# EAGLE design controll (EAGLE 4.90)
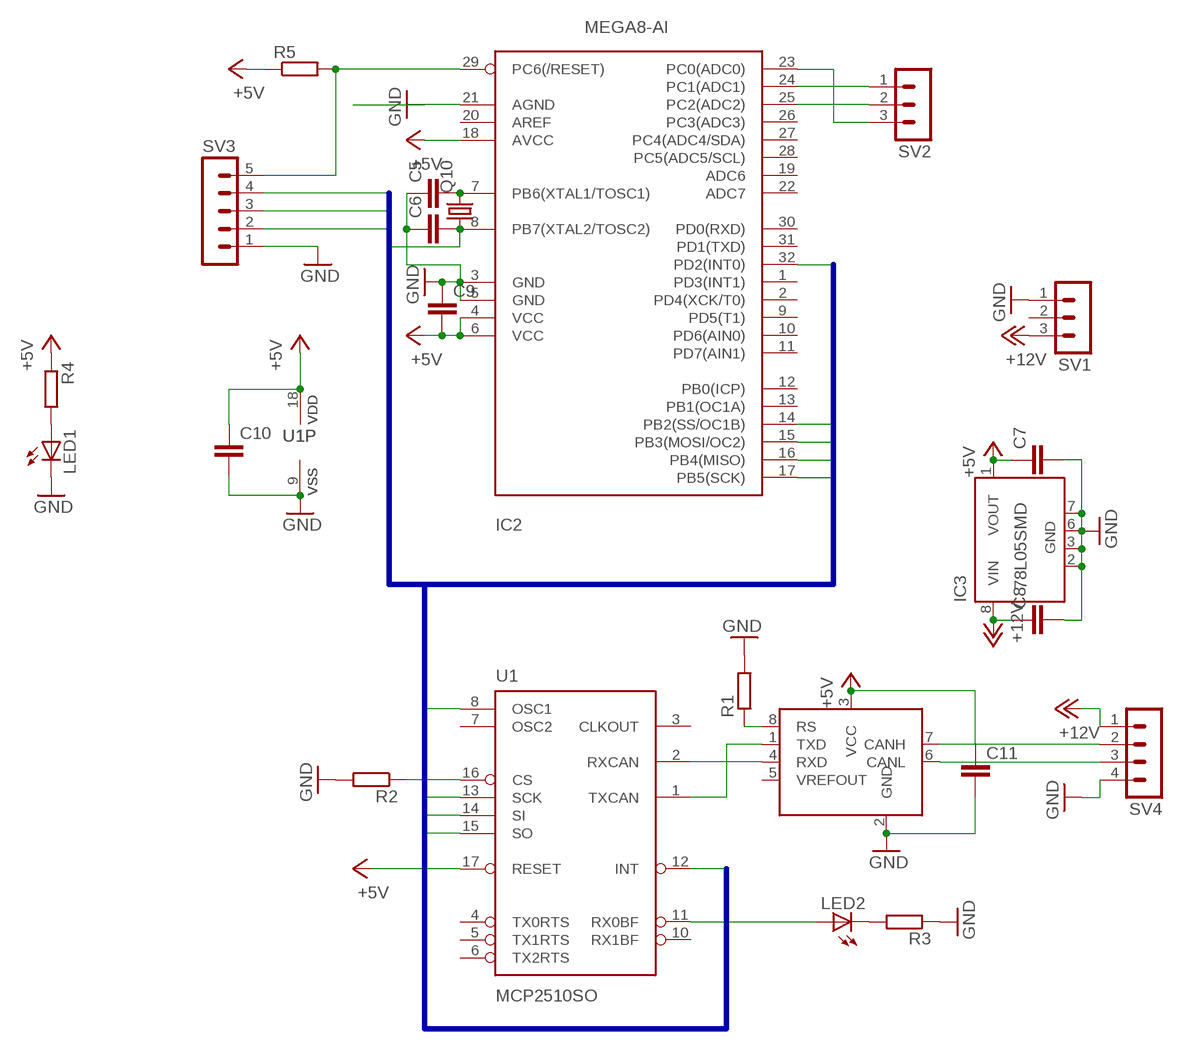
[diagram p0: schematic, sheet 1]

## Parts
C5  C-EUC1206  [C1206]
C6  C-EUC0805  [C0805]
C7  C-EUC0805  [C0805]
C8  C-EUC0805  [C0805]
C9  C-EUC0805  [C0805]
C10  C-EUC0805  [C0805]
C11  C-EUC0805  [C0805]
IC1  82C250SMDSMD  [SO8]
IC2  MEGA8-AI  [TQFP32-08]
IC3  78L05SMD  [SO08]
LED1  LEDCHIPLED_0603  [CHIPLED_0603]
LED2  LEDCHIPLED_0603  [CHIPLED_0603]
Q10  CRYTALHC49S  [HC49/S]
R1  R-EU_R0805  [R0805]
R2  R-EU_R0805  [R0805]
R3  R-EU_R0805  [R0805]
R4  R-EU_R0805  [R0805]
R5  R-EU_R1206  [R1206]
SV1  MA03-1  [MA03-1]
SV2  MA03-1  [MA03-1]
SV3  MA05-1  [MA05-1]
SV4  MA04-1  [MA04-1]
U1  MCP2510SO  [SO-18W]

## Nets
+5V: C7.1 C9.2 C10.1 C11.1 IC1.3(VCC) IC2.4(VCC) IC2.6(VCC) IC2.18(AVCC) IC3.1(VOUT) R4.1 R5.1 U1.17(RESET) U1.18(VDD)
+12V: C8.1 IC3.8(VIN) SV1.3 SV4.1
CLK: C6.2 IC2.8(PB7(XTAL2/TOSC2)) Q10.1 U1.8(OSC1)
GND: C5.1 C6.1 C7.2 C8.2 C9.1 C10.2 C11.2 IC1.2(GND) IC2.3(GND) IC2.5(GND) IC2.21(AGND) IC3.2(GND) IC3.3(GND) IC3.6(GND) IC3.7(GND) LED1.C R1.2 R2.2 R3.1 SV1.1 SV3.1 SV4.4 U1.9(VSS)
INT: IC2.32(PD2(INT0)) U1.12(INT)
MISO: IC2.16(PB4(MISO)) SV3.2 U1.15(SO)
MOSI: IC2.15(PB3(MOSI/OC2)) SV3.3 U1.14(SI)
N$1: IC2.24(PC1(ADC1)) SV2.1
N$2: IC2.23(PC0(ADC0)) SV2.3
N$3: IC2.25(PC2(ADC2)) SV2.2
N$4: IC2.29(PC6(/RESET)) R5.2 SV3.5
N$15: C5.2 IC2.7(PB6(XTAL1/TOSC1)) Q10.2
N$30: LED1.A R4.2
N$34: IC1.7(CANH) SV4.2
N$35: IC1.1(TXD) U1.1(TXCAN)
N$36: IC1.4(RXD) U1.2(RXCAN)
N$37: IC1.8(RS) R1.1
N$38: IC1.6(CANL) SV4.3
N$39: LED2.A U1.11(RX0BF)
N$40: LED2.C R3.2
SCK: IC2.17(PB5(SCK)) SV3.4 U1.13(SCK)
SS: IC2.14(PB2(SS/OC1B)) R2.1 U1.16(CS)
Unconnected: IC1.5(VREFOUT) IC2.1(PD3(INT1)) IC2.2(PD4(XCK/T0)) IC2.9(PD5(T1)) IC2.10(PD6(AIN0)) IC2.11(PD7(AIN1)) IC2.12(PB0(ICP)) IC2.13(PB1(OC1A)) IC2.19(ADC6) IC2.20(AREF) IC2.22(ADC7) IC2.26(PC3(ADC3)) IC2.27(PC4(ADC4/SDA)) IC2.28(PC5(ADC5/SCL)) IC2.30(PD0(RXD)) IC2.31(PD1(TXD)) IC3.4(NC) IC3.5(NC) SV1.2 U1.3(CLKOUT) U1.4(TX0RTS) U1.5(TX1RTS) U1.6(TX2RTS) U1.7(OSC2) U1.10(RX1BF)

## Buses
SPI:SS,MOSI,MISO,SCK,INT,CLK

## Library data of the parts
C5-C11 = rcl:C-EU: CAPACITOR, European symbol
IC1 = philips:82C250SMD
IC2 = atmel:MEGA8: MICROCONTROLLER 8 Kbytes FLASH 1 kbytes SRAM 512 bytes EEPROM USART 6-channel 10 bit ADC 2-channel 8 bit ADC Source: avr.lbr
IC3 = linear:78L*SMD: Positive VOLTAGE REGULATOR
LED1 LED2 = led:LED: LED OSRAM: - CHIPLED LG R971, LG N971, LY N971, LG Q971, LY Q971, LO R971, LY R971 LH N974, LH R974 LS Q976, LO Q976, LY Q976 LO Q996 - Hyper CHIPLED LW Q18S LB Q993, LB Q99A, LB R99A - SideLED LS A670, LO A670, LY A670, LG A670, LP A670 LB A673, LV A673, LT A673, LW A673 LH A674 LY A675 LS A676, LA A676, LO A676, LY A676, LW A676 LS A679, LY A679, LG A679 - Hyper Micro SIDELED® LS Y876, LA Y876, LO Y876, LY Y876 LT Y87S - SmartLED LW L88C, LW L88S LB L89C, LB L89S, LG L890 LS L89K, LO L89K, LY L89K LS L896, LA L896, LO L896, LY L896 - TOPLED LS T670, LO T670, LY T670, LG T670, LP T670 LSG T670, LSP T670, LSY T670, LOP T670, LYG T670 LG T671, LOG T671, LSG T671 LB T673, LV T673, LT T673, LW T673 LH T674 LS T676, LA T676, LO T676, LY T676, LB T676, LH T676, LSB T676, LW T676 LB T67C, LV T67C, LT T67C, LS T67K, LO T67K, LY T67K, LW E67C LS E67B, LA E67B, LO E67B, LY E67B, LB E67C, LV E67C, LT E67C LW T67C LS T679, LY T679, LG T679 LS T770, LO T770, LY T770, LG T770, LP T770 LB T773, LV T773, LT T773, LW T773 LH T774 LS E675, LA E675, LY E675, LS T675 LS T776, LA T776, LO T776, LY T776, LB T776 LHGB T686 LT T68C, LB T68C - Hyper Mini TOPLED® LB M676 - Mini TOPLED Santana® LG M470 LS M47K, LO M47K, LY M47K Source: http://www.osram.convergy.de - LUMILED® LXK2-PW12-R00, LXK2-PW12-S00, LXK2-PW14-U00, LXK2-PW14-V00 LXK2-PM12-R00, LXK2-PM12-S00, LXK2-PM14-U00 LXK2-PE12-Q00, LXK2-PE12-R00, LXK2-PE12-S00, LXK2-PE14-T00, LXK2-PE14-U00 LXK2-PB12-K00, LXK2-PB12-L00, LXK2-PB12-M00, LXK2-PB14-N00, LXK2-PB14-P00, LXK2-PB14-Q00 LXK2-PR12-L00, LXK2-PR12-M00, LXK2-PR14-Q00, LXK2-PR14-R00 LXK2-PD12-Q00, LXK2-PD12-R00, LXK2-PD12-S00 LXK2-PH12-R00, LXK2-PH12-S00 LXK2-PL12-P00, LXK2-PL12-Q00, LXK2-PL12-R00 Source: www.luxeon.com
Q10 = crystal:CRYTAL: CRYSTAL
R1-R5 = rcl:R-EU_: RESISTOR, European symbol
SV1 SV2 = con-lstb:MA03-1: PIN HEADER
SV3 = con-lstb:MA05-1: PIN HEADER
SV4 = con-lstb:MA04-1: PIN HEADER
U1 = microchip_can:MCP2510

## Board
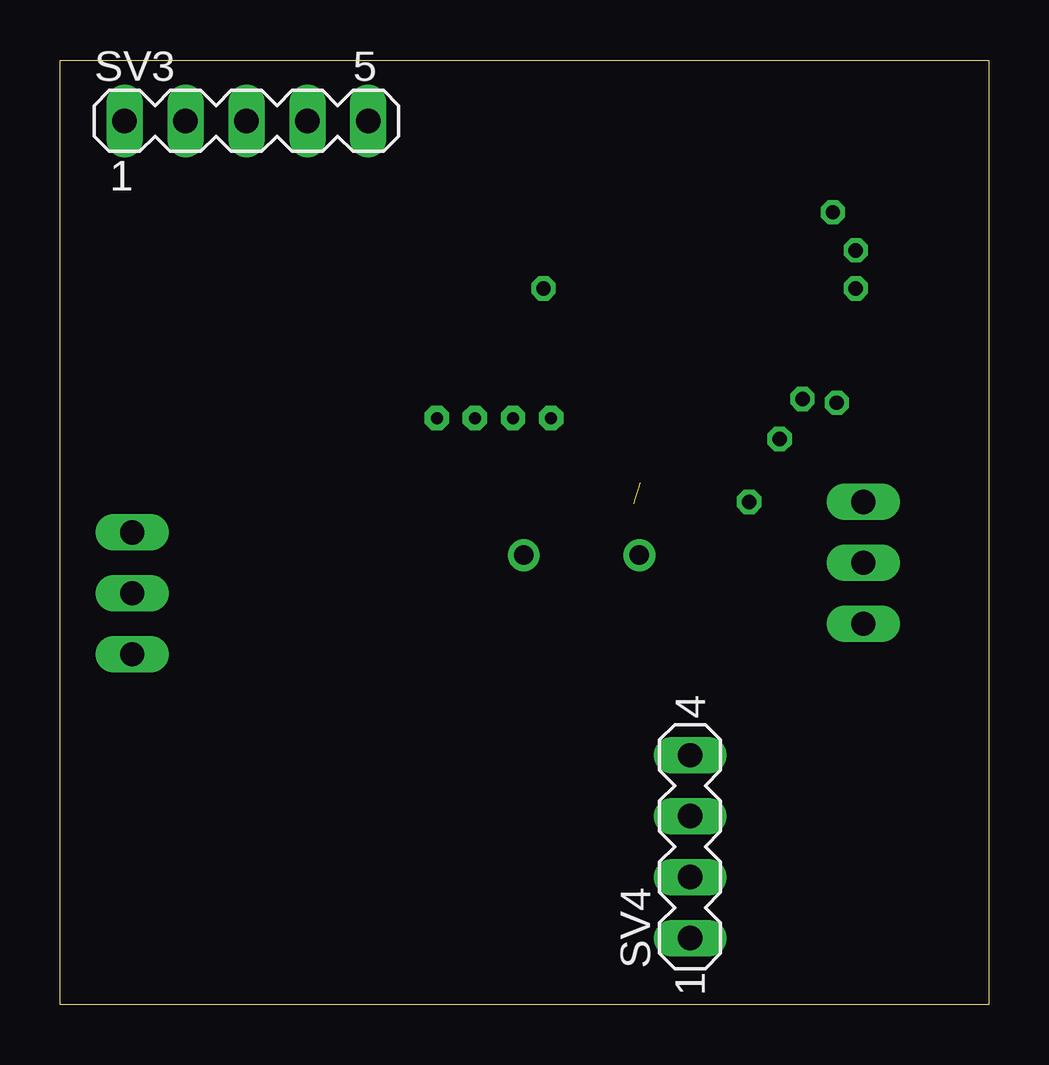
[diagram p1: board, top side]
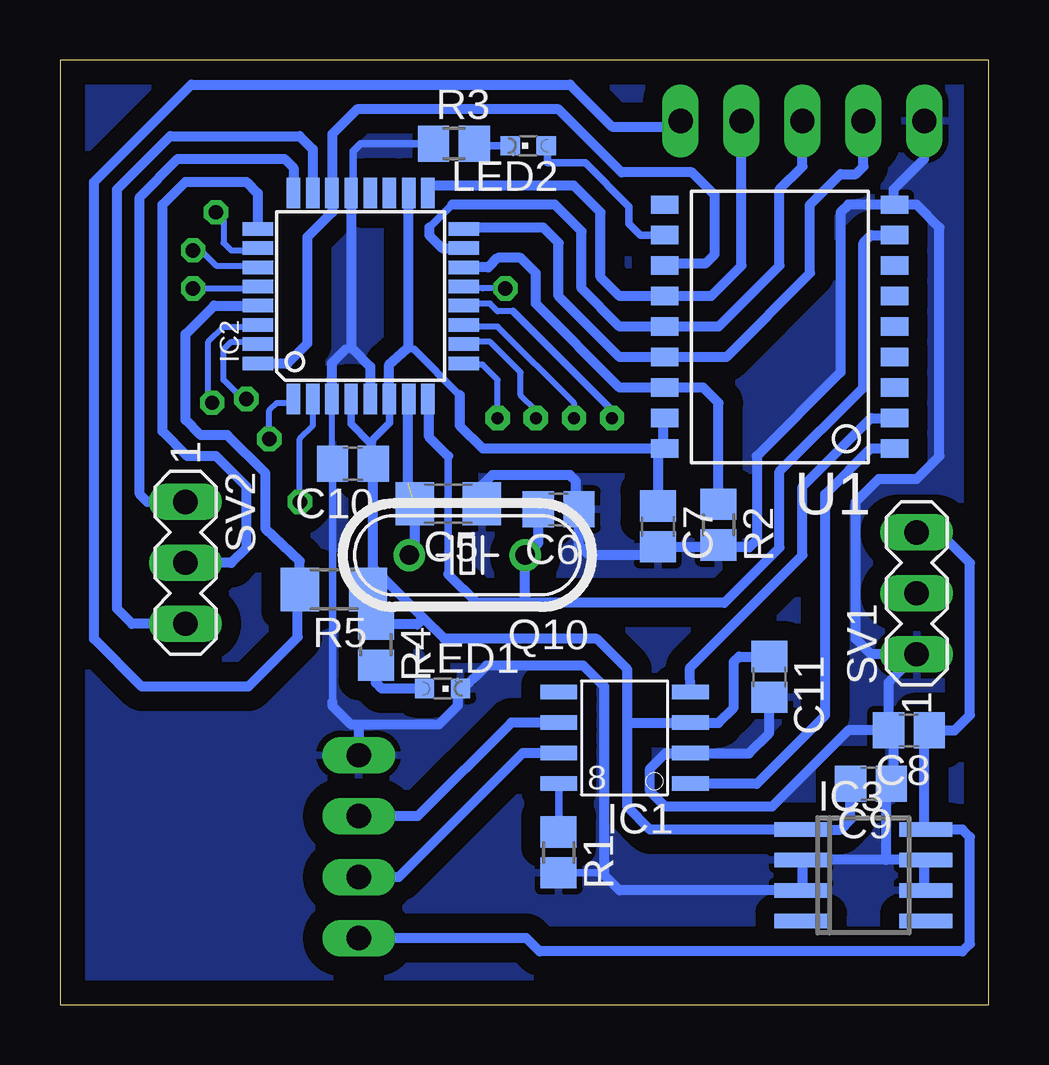
[diagram p2: board, bottom side, seen from below]

Size 38.72 x 39.36 mm. Coordinates in mm from the lower left corner, seen from the top.
Outline: 38.72,0 0,0 0,39.36 38.72,39.36 38.72,0
Copper layers (1*16): Top 0.035mm / dielectric 1.5mm / Bottom 0.035mm
Design rules "default": minimum track width 10mil, minimum drill 24mil, track to track 8mil, track to pad 8mil, pad to pad 8mil, via to via 8mil, smd to smd 8mil, copper to edge 40mil, drill to drill 8mil, minimum pad ring 10mil, minimum via ring 8mil, stop-mask expansion 4mil, vias tented up to drill 0mil, thermal gap 10mil

### Footprints (pad centres in the part's own frame; a part is rotated, then mirrored left to right if it is on the bottom)
C1206 = smd 1.6 x 1.8: 1 -1.4,0; 2 1.4,0
C0805 = smd 1.3 x 1.5: 1 -0.85,0; 2 0.85,0
SO8 = smd 0.61 x 1.524: 1 -1.27,-2.743; 2 0,-2.743; 3 1.27,-2.743; 4 2.54,-2.743; 5 2.54,2.743; 6 1.27,2.743; 7 0,2.743; 8 -1.27,2.743
TQFP32-08 = smd 1.27 x 0.559: 1 -4.293,2.8; 2 -4.293,2; 3 -4.293,1.2; 4 -4.293,0.4; 5 -4.293,-0.4; 6 -4.293,-1.2; 7 -4.293,-2; 8 -4.293,-2.8; 17 4.293,-2.8; 18 4.293,-2; 19 4.293,-1.2; 20 4.293,-0.4; 21 4.293,0.4; 22 4.293,1.2; 23 4.293,2; 24 4.293,2.8 | smd 0.559 x 1.27: 9 -2.8,-4.293; 10 -2,-4.293; 11 -1.2,-4.293; 12 -0.4,-4.293; 13 0.4,-4.293; 14 1.2,-4.293; 15 2,-4.293; 16 2.8,-4.293; 25 2.8,4.293; 26 2,4.293; 27 1.2,4.293; 28 0.4,4.293; 29 -0.4,4.293; 30 -1.2,4.293; 31 -2,4.293; 32 -2.8,4.293
SO08 = smd 0.6 x 2.2: 1 -1.905,-2.6; 2 -0.635,-2.6; 3 0.635,-2.6; 4 1.905,-2.6; 5 1.905,2.6; 6 0.635,2.6; 7 -0.635,2.6; 8 -1.905,2.6
CHIPLED_0603 = smd 0.8 x 0.8: A 0,-0.75; C 0,0.75
HC49/S = drill 0.813 round: 1 -2.413,0; 2 2.413,0
R0805 = smd 1.3 x 1.5: 1 -0.85,0; 2 0.85,0
R1206 = smd 1.6 x 1.803: 1 -1.422,0; 2 1.422,0
MA03-1 = drill 1.016 long: 1 -2.54,0; 2 0,0; 3 2.54,0
MA05-1 = drill 1.016 long: 1 -5.08,0; 2 -2.54,0; 3 0,0; 4 2.54,0; 5 5.08,0
MA04-1 = drill 1.016 long: 1 -3.81,0; 2 -1.27,0; 3 1.27,0; 4 3.81,0
SO-18W = smd 0.762 x 1.143: 1 -5.08,-4.788; 2 -3.81,-4.788; 3 -2.54,-4.788; 4 -1.27,-4.788; 5 0,-4.788; 6 1.27,-4.788; 7 2.54,-4.788; 8 3.81,-4.788; 9 5.08,-4.788; 10 5.08,4.788; 11 3.81,4.788; 12 2.54,4.788; 13 1.27,4.788; 14 0,4.788; 15 -1.27,4.788; 16 -2.54,4.788; 17 -3.81,4.788; 18 -5.08,4.788

### Placement (x,y rotation side)
C5  22.54,20.87 180 bottom
C6  17.93,20.63 180 bottom
C7  13.8,19.93 270 bottom
C8  3.33,11.43 180 bottom
C9  4.92,9.2 180 bottom
C10  26.51,22.54 180 bottom
C11  9.15,13.66 270 bottom
IC1  15.18,10.48 90 bottom
IC2  26.19,29.52 90 bottom
IC3  5.23,5.39 270 bottom
LED1  22.77,13.17 270 bottom
LED2  19.2,35.79 90 bottom
Q10  21.74,18.73 180 bottom
R1  17.93,6.34 270 bottom
R2  11.27,20 270 bottom
R3  22.3,35.87 0 bottom
R4  25.55,15 270 bottom
R5  27.3,17.3 180 bottom
SV1  3.01,17.14 90 bottom
SV2  33.49,18.41 270 bottom
SV3  7.77,36.83 0 top
SV4  26.27,6.58 90 top
U1  8.73,28.25 90 bottom

### Tracks (layer width: path | path; a pad name or v marks a point on that pad's centre or on a via)
+5V
  Bottom 0.254: C10.1 25.66,23.42 25.81,23.42 | 25,25.39 24.99,25.32 IC2.6 | 24.19,27.39 24.28,27.3 23.96,27.3 | 13.81,23.17 U1.18 | 13.81,20.63 13.8,20.64 C7.1 | 12.54,11.74 12.53,11.75 IC1.3 | IC3.1 7.77,7.3
  Bottom 0.305: IC2.4 26.59,24.2 25.81,23.42 24.99,24.24 IC2.6 | 23.96,27.3 22.06,25.39 | 25.27,17.81 25.31,17.81 25.31,17.22 | 25.31,17.22 | R5.1 25.31,17.3 25.31,17.22
  Bottom 0.406: 24.28,27.3 25,26.66 25,25.39 | 22.06,25.39 22.06,24.12 21.11,23.17 13.81,23.17 13.81,20.63 | 24.19,27.39 IC2.18 | C10.1 25.66,18.2 25.27,17.81 23.57,16.11 | C11.1 10.41,14.51 10.63,14.28 10.63,12.38 11.27,11.74 12.54,11.74 | C9.2 5.76,7.72 6.18,7.3 7.77,7.3 14.12,7.3 15.08,8.25 15.08,11.74 | U1.18 13.57,23.17 13.57,24.44 | 13.57,24.44 13.57,24.52 | 13.57,24.44 U1.17 | 23.57,16.11 | R4.1 23.83,15.85 23.57,16.11 | 15.08,11.74 15.08,13.97 16.34,15.24 22.7,15.24 23.57,16.11 | 12.53,11.75 15.07,11.75 15.08,11.74
+12V
  Bottom 0.254: C8.1 2.38,11.43 2.69,11.11 | IC3.8 2.69,7.3
  Bottom 0.406: C8.1 1.42,11.43 0.79,12.06 0.79,18.41 2.06,19.68 SV1.3 | 2.69,7.3 2.69,11.11 | IC3.8 1.1,7.3 0.79,6.98 0.79,2.54 1.1,2.22 18.73,2.22 19.28,2.77 SV4.1 | SV4.1
CLK
  Bottom 0.305: 22.54,17.93 22.54,22.86
  Bottom 0.406: U1.8 4.92,32.06 5.23,31.74 5.23,25.71 8.73,22.22 8.73,19.04 11.03,16.74 19.36,16.74 | 19.36,16.74 21.35,16.74 22.54,17.93 | 22.54,22.86 23.33,23.65 23.33,25 23.41,25.08 23.39,25.1 IC2.8 | 19.33,18.68 19.36,18.65 | 19.33,18.68 Q10.1 19.33,16.93 19.36,16.9 19.36,16.74 | C6.2 18.78,19.23 19.33,18.68
GND
  Bottom 0.254: 26.57,33.21 IC2.21 | 26.82,27.3 26.5,27.3 26.57,27.36 | C10.2 27.46,22.54 27.39,22.61 IC2.3 | 3.96,11.43 C8.2 3.96,11.21 | U1.9 3.96,33.36 | 14.12,19.05 14.02,19.15 | 14.12,19.05 14.12,19.04 14.12,18.73 C7.2 14.12,19.05 | 11.27,19.04 11.27,19.05 R2.2 | 3.96,9.2 C9.1 4.28,8.99 | IC3.6 2.69,4.76 | 2.69,5.97 IC3.7 | IC3.2 7.77,5.97 | 12.54,10.47 12.53,10.48 IC1.2 | 7.77,4.76 IC3.3 | 16.03,5.39 16.13,5.5
  Bottom 0.305: 16.13,5.5 R1.2 | R3.1 26.19,35.87 26.5,35.55 26.5,33.89 IC2.21 | 27.36,12.6 C10.2
  Bottom 0.406: IC2.5 25.79,26.58 26.5,27.3 | IC2.3 27.39,26.73 26.82,27.3 | 26.57,27.36 26.57,33.21 | SV3.1 2.69,35.24 3.96,33.97 3.96,33.36 | 14.12,19.05 11.27,19.05 9.99,19.05 9.68,19.36 9.68,22.86 6.18,26.35 6.18,33.02 5.87,33.33 U1.9 3.01,33.33 2.06,32.38 2.06,22.86 3.01,21.9 4.6,21.9 5.55,20.95 5.55,15.24 4.92,14.6 SV1.1 4.18,13.43 C8.2 5.87,11.43 9.04,8.25 13.49,8.25 14.12,8.89 14.12,9.84 13.48,10.48 IC1.2 | 14.12,18.73 16.66,18.73 17.08,19.15 C6.1 17.08,20.69 17.06,20.71 17.22,20.87 17.22,21.82 17.46,22.06 20.71,22.06 21.14,21.64 C5.1 | 3.96,9.2 3.96,11.21 | 4.28,6.03 4.28,8.99 | IC3.7 4.28,6.03 | 2.69,4.76 2.69,5.97 | 4.28,6.03 IC3.2 | 7.77,5.97 7.77,4.76 15.39,4.76 16.03,5.39 16.03,13.25 16.9,14.12 20.95,14.12 21.98,13.09 22.02,13.14 LED1.C | C11.2 9.15,11.32 10,10.47 12.54,10.47 | 21.98,13.17 | LED1.C 21.98,13.17 | LED1.C 22.14,13.17 22.14,12.46 22.93,11.66 26.27,11.66 | SV4.4 | 26.27,11.66 SV4.4 | 27.36,12.6 27.36,12.47 27.38,12.46 26.58,11.66 26.27,11.66
  pour Bottom (isolate 0.813): 0.47,39.05 38.25,39.05 38.25,0.31 0.15,0.31 0.15,39.05
INT
  Bottom 0.254: 30.81,26.7 IC2.32
  Bottom 0.406: 30.81,26.7 29.25,26.7 28.41,27.54 28.41,31.98 27.38,33.02 27.38,36.27 | U1.12 13.57,30.79 13.49,30.87 11.82,30.87 11.42,31.27 11.42,33.73 12.38,34.68 15.31,34.68 | 15.31,34.68 | 15.31,34.68 17.93,37.3 26.35,37.3 27.38,36.27 | 27.38,36.27
MISO
  Bottom 0.254: 21.49,32.44 IC2.16 21.84,32.38
  Bottom 0.406: 21.84,32.38 18.57,32.38 17.93,31.74 17.93,29.52 15.39,26.98 U1.15 10.95,26.98 7.46,30.47 7.46,33.33 6.18,34.6 5.55,34.6 5.23,34.92 SV3.2
MOSI
  Bottom 0.305: 22.38,33.33 23.33,32.38
  Bottom 0.406: IC2.15 22.79,31.52 23.33,32.06 23.33,32.38 | 22.38,33.33 18.09,33.33 16.98,32.22 16.98,29.84 15.39,28.25 U1.14 11.27,28.25 8.73,30.79 8.73,33.97 7.77,34.92 SV3.3
N$1
  Bottom 0.406: IC2.24 28.99,34.86 29.36,35.24 33.81,35.24 35.39,33.65 35.39,21.27 35.08,20.95 SV2.1
N$2
  Bottom 0.406: IC2.23 28.19,35.65 28.73,36.19 34.12,36.19 36.35,33.97 36.35,16.5 35.71,15.87 SV2.3
N$3
  Bottom 0.406: IC2.25 30.48,33.82 30.95,34.29 33.49,34.29 34.44,33.33 34.44,23.89 33.41,22.86 32.22,22.86 30.95,21.58 30.95,19.04 31.58,18.41 SV2.2 33.81,18.41
N$4
  Bottom 0.305: R5.2 28.73,17.22 | 28.73,17.14 28.65,17.14 28.65,17.3 R5.2
  Bottom 0.406: IC2.29 32.3,29.12 33.49,27.93 33.49,24.36 32.85,23.73 31.74,23.73 30.16,22.14 | 30.16,22.14 30.16,19.84 28.73,18.49 R5.2 | R5.2 28.73,17.14 | 30.16,22.14 | R5.2 | R5.2 28.81,17.22 28.81,15.31 30.87,13.25 35.32,13.25 37.3,15.24 37.3,34.29 33.25,38.33 17.46,38.33 15.71,36.59 13.01,36.59 12.85,36.75 SV3.5
N$6  (via drill 0.6)
  Bottom 0.254: 30.95,27.62 31.58,27.62 31.9,27.3 31.9,26.03 31.11,25.24 v30.95,25.24
N$7  (via drill 0.6)
  Bottom 0.254: 30.95,28.25 31.9,28.25 32.54,27.62 32.54,25.08 v32.38,25.08
N$9  (via drill 0.6)
  other vias: 33.17,29.84
N$10  (via drill 0.6)
  other vias: 33.17,31.43
N$11  (via drill 0.6)
  other vias: 32.22,33.02
N$12
  Bottom 0.254: 30.95,31.43 31.58,31.43 31.9,31.74 31.9,32.7
N$13
  Bottom 0.254: 30.95,30.79 32.22,30.79 32.85,31.43
N$14  (via drill 0.6 pad 1.02)
  other vias: 30,23.57
N$15  (1 unrouted)
  Bottom 0.254: 24.2,24.66 IC2.7
  Bottom 0.406: 24.2,21.74 24.2,24.66 | Q10.2 24.12,18.73 23.94,18.91 C5.2
N$16
  Bottom 0.254: 32.85,29.84 30.95,29.84
N$17  (via drill 0.5 pad 1.02)
  other vias: 20.47,24.44
N$18  (via drill 0.5 pad 1.02)
  other vias: 18.88,24.44
N$19  (via drill 0.5 pad 1.02)
  other vias: 17.3,24.44
N$20
  Bottom 0.254: 21.74,26.66 21.11,26.66 20.47,26.03 20.47,24.76
N$21
  Bottom 0.254: 21.42,27.62 20.79,27.62 19.52,26.35 19.52,25.39 18.88,24.76
N$22
  Bottom 0.254: 21.42,28.25 20.47,28.25 17.3,25.08 17.3,24.76
N$23  (via drill 0.6)
  other vias: 20.15,29.84
N$24  (via drill 0.6 pad 1.02)
  other vias: 28.73,20.95
N$25
  Bottom 0.254: 29.2,25.08 29.68,25.08 30,24.76 30,23.89
N$26
  Bottom 0.254: 28.17,24.76 28.17,24.12 28.73,23.57 28.73,20.95
N$27
  Bottom 0.254: 21.42,29.84 21.11,29.84 20.47,29.84
N$28
  Bottom 0.254: 21.42,29.2 20.79,29.2 20.47,28.89 19.84,28.89
  Bottom 0.305: 15.71,24.76 19.84,28.89
N$29  (via drill 0.5 pad 1.02)
  other vias: 15.71,24.44
N$30
  Bottom 0.406: 25.53,14.15 25.47,14.2 | 25.53,14.15 R4.2 25.55,14.2 | 25.53,14.15 25.55,14.12 | LED1.A 25.31,13.17 25.55,13.41 25.55,14.2 | 25.55,14.2
N$34
  Bottom 0.406: IC1.7 19.43,10.48 24.6,5.31 SV4.2 | SV4.2
N$35
  Bottom 0.254: 12.54,9.2 12.53,9.21 IC1.1
  Bottom 0.406: U1.1 4.92,23.17 6.82,21.27 6.82,12.06 9.68,9.2 12.54,9.2
N$36
  Bottom 0.254: IC1.4
  Bottom 0.406: U1.2 4.92,24.44 7.77,21.58 7.77,18.73 12.46,14.04 IC1.4
N$37
  Bottom 0.254: R1.1 17.93,6.98 17.93,6.99
  Bottom 0.305: 17.93,6.99 IC1.8
N$38
  Bottom 0.406: IC1.6 19.91,11.75 23.81,7.85 26.35,7.85 | 26.35,7.85 26.35,7.93 | 26.35,7.85 SV4.3 | 26.35,7.85
N$39
  Bottom 0.305: U1.11 14.52,32.06 15,32.54 15,33.25 16.82,35.08 18.41,35.08 18.41,35.64 18.49,35.71 18.45,35.75 LED2.A
N$40
  Bottom 0.305: R3.2 21.5,35.87 21.42,35.79 LED2.C
SCK
  Bottom 0.254: IC2.17 23.53,33.82 23.21,34.12
  Bottom 0.406: SV3.4 10.31,30.79 11.58,29.52 U1.13 15.39,29.52 16.19,30.32 16.19,33.02 17.3,34.12 23.21,34.12
SS
  Bottom 0.254: U1.16 13.49,25.71
  Bottom 0.406: IC2.14 20.86,30.72 20.47,31.11 19.52,31.11 18.88,30.47 18.88,29.2 15.39,25.71 U1.16 11.9,25.71 11.27,25.08 R2.1